# EAGLE design working (EAGLE 5.10)
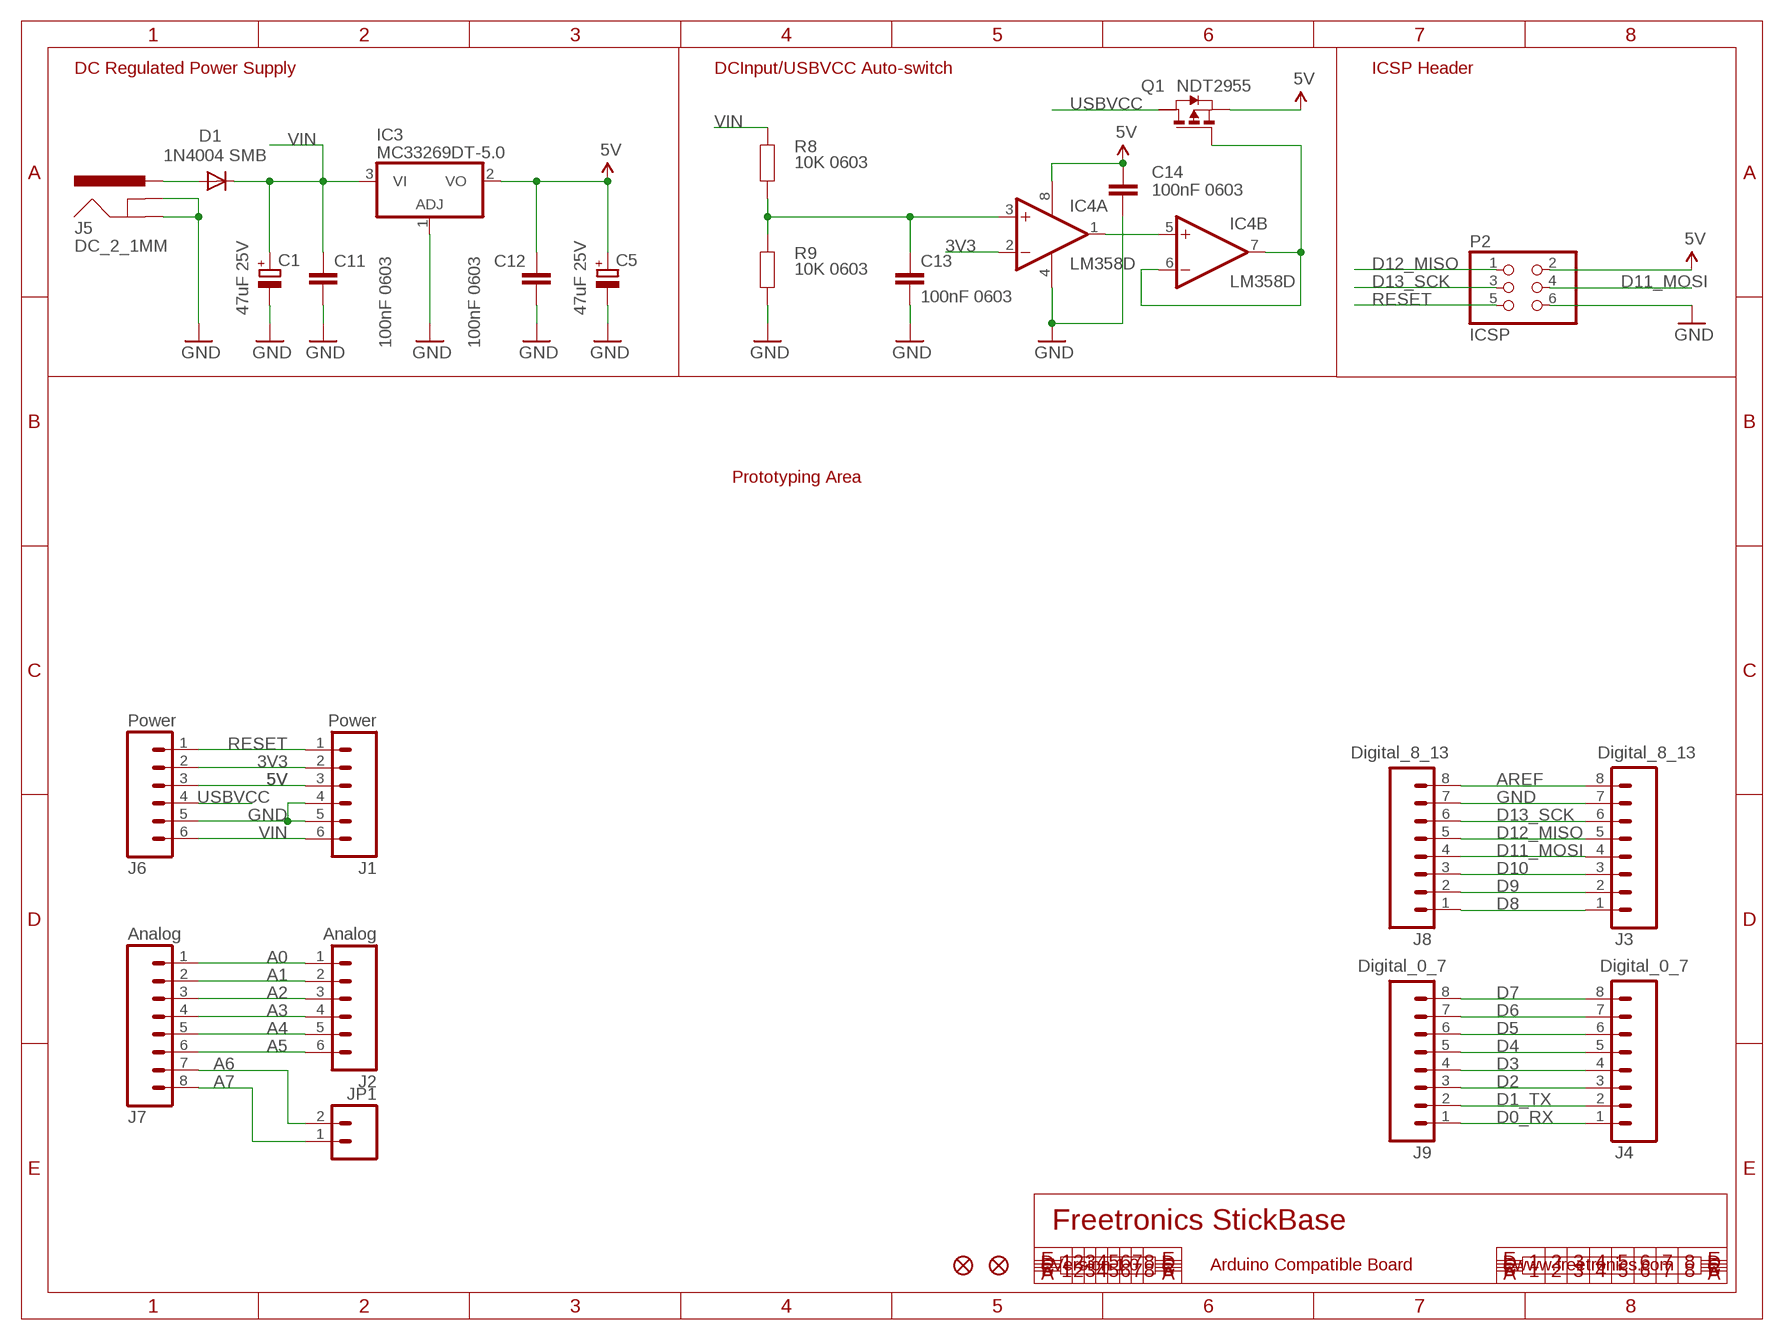
[diagram p0: schematic, sheet 1]

## Parts
C1  47uF 25V  CPOL-EUD  [PANASONIC_D]
C5  47uF 25V  CPOL-EUD  [PANASONIC_D]
C11  100nF 0603  CAP0603  [0603]
C12  100nF 0603  CAP0603  [0603]
C13  100nF 0603  CAP0603  [0603]
C14  100nF 0603  CAP0603  [0603]
D1  1N4004 SMB  DIODESMB  [SMB-DIODE]
IC3  MC33269DT-5.0  MC33269D-5.0  [DPACK]
IC4  LM358D  [SO08]
J1  Power  M06SIP  [1X06]
J2  Analog  M06SIP  [1X06]
J3  Digital_8_13  M08  [1X08]
J4  Digital_0_7  M08  [1X08]
J5  DC_2_1MM  POWER_JACKPTH  [POWER_JACK_PTH]
J6  Power  M06SIP  [1X06]
J7  Analog  M08  [1X08]
J8  Digital_8_13  M08  [1X08]
J9  Digital_0_7  M08  [1X08]
JP1  M02PTH  [1X02]
P2  ICSP  PINHD-2X3  [2X03]
Q1  NDT2955  PMOSSOT223  [SOT223]
R8  10K 0603  RESISTOR0603  [0603]
R9  10K 0603  RESISTOR0603  [0603]
U$5  FIDUCIAL1X2.5  [FIDUCIAL-1X2.5]
U$14  FIDUCIAL1X2.5  [FIDUCIAL-1X2.5]

## Nets
3V3: IC4.2(A:-IN) J1.2 J6.2
5V: C5.+ C12.1 C14.1 IC3.2(VO) IC4.8(P:V+) J1.3 J6.3 P2.2 Q1.3(S)
A0: J2.1 J7.1
A1: J2.2 J7.2
A2: J2.3 J7.3
A3: J2.4 J7.4
A4: J2.5 J7.5
A5: J2.6 J7.6
A6: J7.7 JP1.2
A7: J7.8 JP1.1
AREF: J3.8 J8.8
D0_RX: J4.1 J9.1
D1_TX: J4.2 J9.2
D2: J4.3 J9.3
D3: J4.4 J9.4
D4: J4.5 J9.5
D5: J4.6 J9.6
D6: J4.7 J9.7
D7: J4.8 J9.8
D8: J3.1 J8.1
D9: J3.2 J8.2
D10: J3.3 J8.3
D11_MOSI: J3.4 J8.4 P2.4
D12_MISO: J3.5 J8.5 P2.1
D13_SCK: J3.6 J8.6 P2.3
GND: C1.- C5.- C11.2 C12.2 C13.2 C14.2 IC3.1(ADJ) IC4.4(P:V-) J1.4 J1.5 J3.7 J5.GND J5.GNDBREAK J6.5 J8.7 P2.6 R9.1
N$8: D1.A J5.PWR
N$9: C13.1 IC4.3(A:+IN) R8.1 R9.2
N$16: IC4.6(B:-IN) IC4.7(B:OUT) Q1.1(G)
N$17: IC4.1(A:OUT) IC4.5(B:+IN)
RESET: J1.1 J6.1 P2.5
USBVCC: J6.4 Q1.2(D)
VIN: C1.+ C11.1 D1.C IC3.3(VI) J1.6 J6.6 R8.2
Unconnected: Q1.4(D2)

## Notes on the sheet
- DC Regulated Power Supply | DCInput/USBVCC Auto-switch | ICSP Header
- Prototyping Area
- Freetronics StickBase
- Version 1.0 | Arduino Compatible Board | www.freetronics.com

## Library data of the parts
C1 C5 = rcl:CPOL-EU: POLARIZED CAPACITOR, European symbol
C11-C14 = freetronics:CAP: Capacitor Standard 0603 ceramic capacitor, and 0.1" leaded capacitor.
D1 = freetronics:DIODE: Diode These are standard reverse protection diodes and small signal diodes. SMA package can handle up to about 1A. SOD-323 can handle about 200mA. What the SOD-323 package when ordering, there are some mfgs out there that are 5-pin packages.
IC3 = linear:MC33269?*: Adjustable Output Low Dropout Voltage Regulator 800 mA Source: http://www.onsemi.com/pub/Collateral/MC33269-D.PDF
IC4 = linear:LM358: OP AMP also LM158; LM258; LM2904 Source: http://cache.national.com/ds/LM/LM158.pdf
J1 J2 J6 = freetronics:M06: Header 6 Standard 6-pin 0.1" header. Use with straight break away headers (SKU : PRT-00116), right angle break away headers (PRT-00553), swiss pins (PRT-00743), machine pins (PRT-00117), and female headers (PRT-00115). Molex polarized connector foot print use with SKU : PRT-08094 with associated crimp pins and housings. NOTES ON THE VARIANTS LOCK and LOCK_LONGPADS... This footprint was designed to help hold the alignment of a through-hole component (i.e. 6-pin header) while soldering it into place. You may notice that each hole has been shifted either up or down by 0.005 of an inch from it's more standard position (which is a perfectly straight line). This slight alteration caused the pins (the squares in the middle) to touch the edges of the holes. Because they are alternating, it causes a "brace" to hold the component in place. 0.005 has proven to be the perfect amount of "off-center" position when using our standard breakaway headers. Although looks a little odd when you look at the bare footprint, once you have a header in there, the alteration is very hard to notice. Also, if you push a header all the way into place, it is covered up entirely on the bottom side. This idea of altering the position of holes to aid alignment will be further integrated into the Sparkfun Library for other footprints. It can help hold any component with 3 or more connection pins.
J3 J4 J8 J9 = freetronics:M08: Header 8 Standard 8-pin 0.1" header. Use with straight break away headers (SKU : PRT-00116), right angle break away headers (PRT-00553), swiss pins (PRT-00743), machine pins (PRT-00117), and female headers (PRT-00115).
J5 = freetronics:POWER_JACK: Power Jack This is the standard 5.5mm barrel jack for power. The PTH is the most common, proven, reliable, footprint. All others are experimental. The Slot footprint only works if the mill layer is transmitted to the PCB fab house so be warned. Spark Fun Electronics SKU : PRT-00119. Mating wall wart : TOL-00298 (and others)
J7 = freetronics-master-v1:M08: Header 8 Standard 8-pin 0.1" header. Use with straight break away headers (SKU : PRT-00116), right angle break away headers (PRT-00553), swiss pins (PRT-00743), machine pins (PRT-00117), and female headers (PRT-00115).
JP1 = freetronics-master-v1:M02: Header 2 Standard 2-pin 0.1" header. Use with straight break away headers (SKU : PRT-00116), right angle break away headers (PRT-00553), swiss pins (PRT-00743), machine pins (PRT-00117), and female headers (PRT-00115). Molex polarized connector foot print use with SKU : PRT-08233 with associated crimp pins and housings.
P2 = pinhead:PINHD-2X3: PIN HEADER
Q1 = zetex:PMOSSOT223: MOS FET
R8 R9 = freetronics:RESISTOR: Resistor Basic schematic elements and footprints for 0603, 1206, and PTH 1/10th watt (small) resistors.
U$5 U$14 = freetronics:FIDUCIAL: Fiducial Alignment Points Various fiducial points for machine vision alignment.

## Board
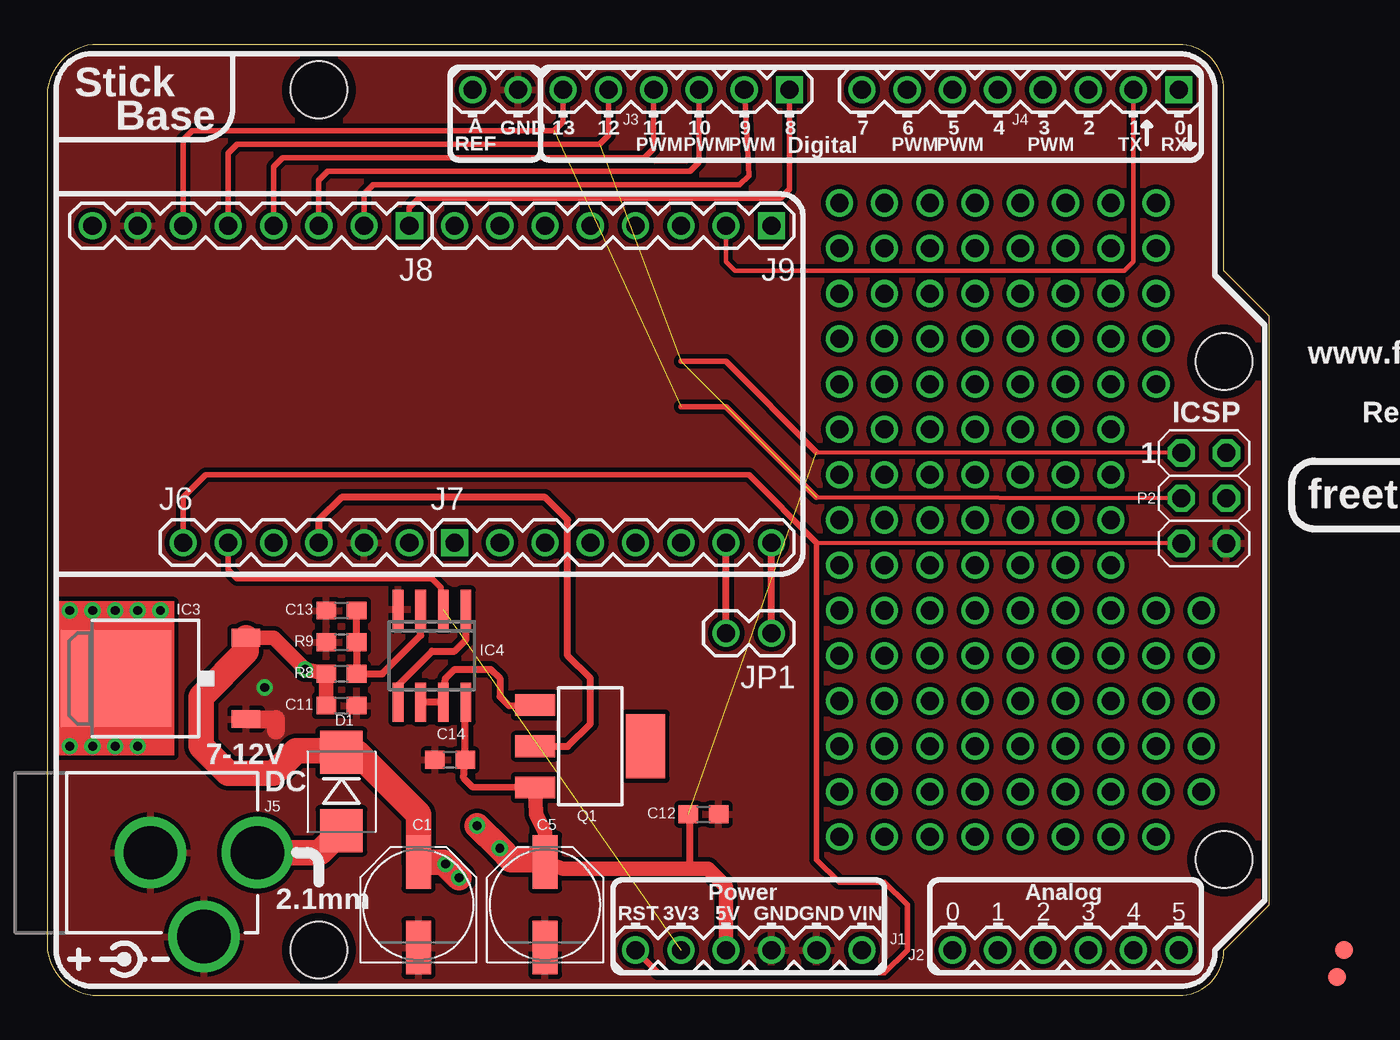
[diagram p1: board, top side]
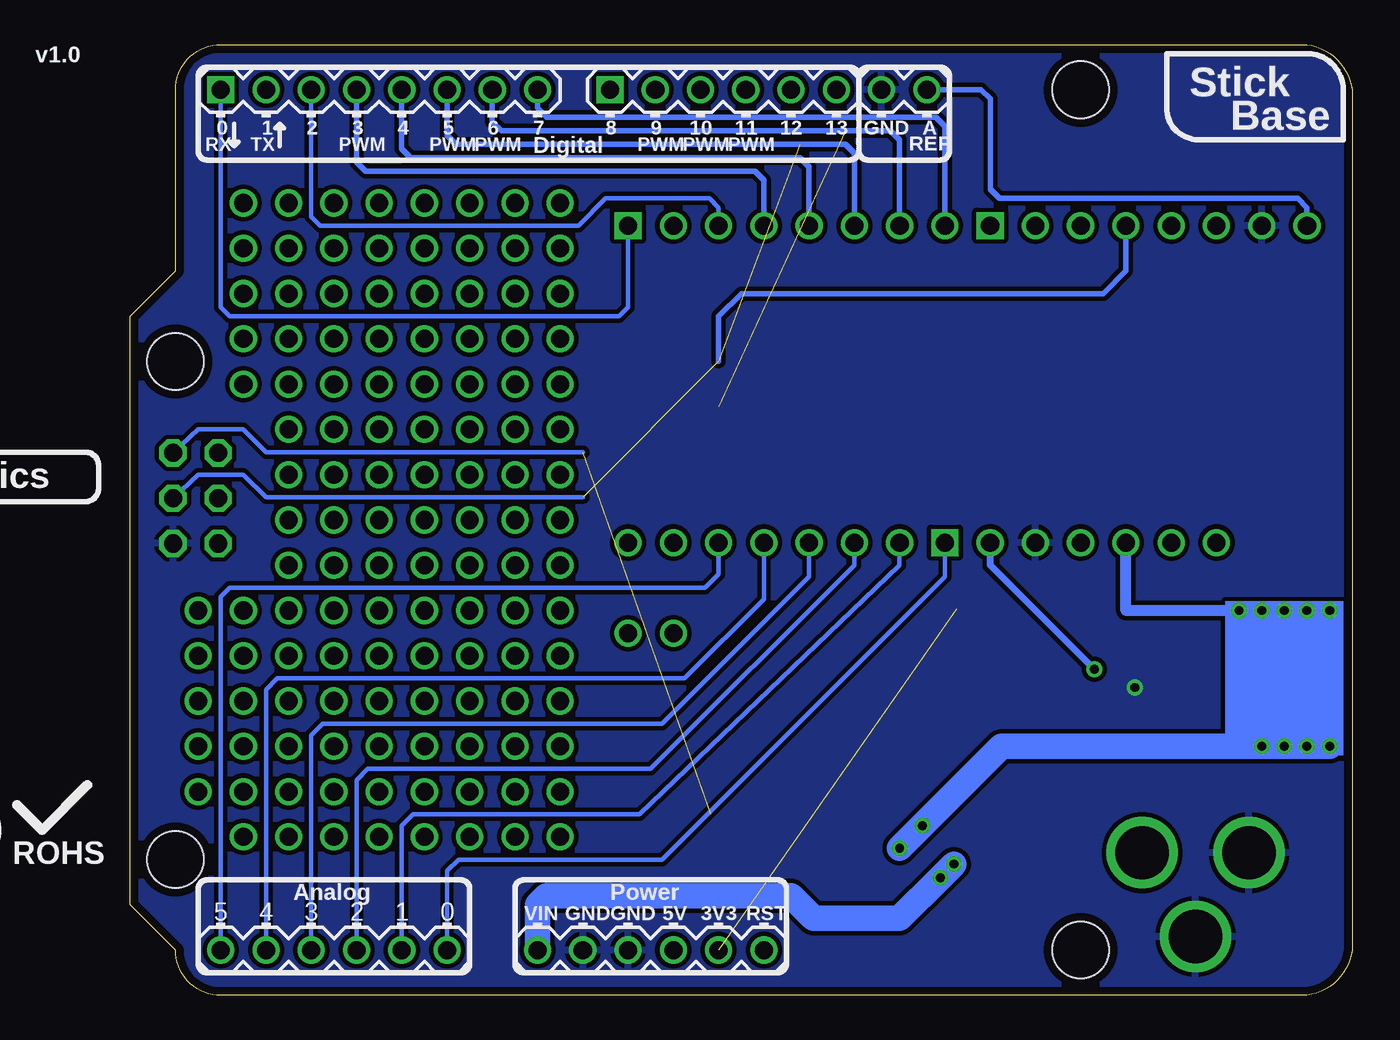
[diagram p2: board, bottom side, seen from below]

Size 68.58 x 53.34 mm. Coordinates in mm from the lower left corner, seen from the top.
Outline: 0,2.54 arc74 2.54,0 63.5,0 arc90 66.04,2.54 68.58,5.08 68.58,38.1 66.04,40.64 66.04,50.8 arc90 63.5,53.34 2.54,53.34 arc74 0,50.8 0,2.54
Copper layers (1*16): Top 0.035mm / dielectric 1.5mm / Bottom 0.035mm
Design rules "default *": minimum track width 10mil, minimum drill 18mil, track to track 10mil, track to pad 10mil, pad to pad 10mil, via to via 10mil, smd to smd 8mil, copper to edge 18mil, drill to drill 8mil, minimum pad ring 10mil, minimum via ring 8mil, stop-mask expansion 4mil, vias tented up to drill 25mil, thermal gap 10mil
Holes 3.2 mm at 66.04,35.56 66.04,7.62 15.24,50.8 15.24,2.54
tRestrict: area 74.3,2.8 to 76.3,4.8; area 77.7,1.3 to 79.8,3.3

### Footprints (pad centres in the part's own frame; a part is rotated, then mirrored left to right if it is on the bottom)
PANASONIC_D = smd 3 x 1.4: + 2.4,0; - -2.4,0
0603 = smd 1.1 x 1: 1 -0.85,0; 2 0.85,0
SMB-DIODE = smd 2.4 x 2.4: A 2.2,0; C -2.2,0
DPACK = smd 1 x 1.6: 1 -2.28,-4.8; 3 2.28,-4.8 | smd 5.4 x 6.2: 2 0,2.5
SO08 = smd 0.6 x 2.2: 1 -1.905,-2.6; 2 -0.635,-2.6; 3 0.635,-2.6; 4 1.905,-2.6; 5 1.905,2.6; 6 0.635,2.6; 7 -0.635,2.6; 8 -1.905,2.6
1X06 = drill 1.016 round: 1 0,0; 2 2.54,0; 3 5.08,0; 4 7.62,0; 5 10.16,0; 6 12.7,0
1X08 = drill 1.016 square: 1 0,0 | drill 1.016 round: 2 2.54,0; 3 5.08,0; 4 7.62,0; 5 10.16,0; 6 12.7,0; 7 15.24,0; 8 17.78,0
POWER_JACK_PTH = drill 2.997 round: GND 0,7.7; GNDBREAK 4.7,10.7; PWR 0,13.7
1X02 = drill 1.016 round: 1 0,0; 2 2.54,0
2X03 = drill 1.016 octagon: 1 -2.54,-1.27; 2 -2.54,1.27; 3 0,-1.27; 4 0,1.27; 5 2.54,-1.27; 6 2.54,1.27
SOT223 = smd 1.219 x 2.235: 1 -2.311,-3.099; 2 0,-3.099; 3 2.311,-3.099 | smd 3.6 x 2.2: 4 0,3.099
FIDUCIAL-1X2.5 = smd 1 x 1: 1 0,0

### Placement (x,y rotation side)
C1  20.83,5.08 90 top
C5  27.94,5.08 90 top
C11  16.51,16.26 0 top
C12  36.83,10.16 0 top
C13  16.51,21.59 180 top
C14  22.61,13.21 180 top
D1  16.51,11.43 270 top
IC3  6.35,17.78 90 top
IC4  21.59,19.05 180 top
J1  33.02,2.54 0 top
J2  50.8,2.54 0 top
J3  41.66,50.8 180 top
J4  63.5,50.8 180 top
J5  -1.91,8 270 top
J6  7.62,25.4 0 top
J7  22.86,25.4 0 top
J8  20.32,43.18 180 top
J9  40.64,43.18 180 top
JP1  40.64,20.32 180 top
P2  64.91,27.89 270 top
Q1  30.48,13.97 270 top
R8  16.51,18.03 180 top
R9  16.51,19.81 0 top
U$5  72.77,2.54 0 top  (outside the outline)
U$14  72.39,1.02 0 top  (outside the outline)

### Tracks (layer width: path | path; a pad name or v marks a point on that pad's centre or on a via)
3V3  (1 unrouted)
  Top 0.305: IC4.2 22.1,22.61 22.1,22.86 21.59,23.37 10.67,23.37 10.16,23.88 J6.2
5V  (via drill 0.5)  (1 unrouted)
  Top 0.406: IC4.8 23.46,16.41 C14.1 23.37,12.19 23.88,11.68 Q1.3 | v3.81,13.97 v2.54,13.97 v1.27,13.97 v5.08,13.97 v3.81,13.97 | v3.81,13.97 3.81,17.27 IC3.2 | v1.27,21.59 v2.54,21.59 v3.81,21.59 v5.08,21.59 | C12.1 36.07,9.65 36.07,7.11
  Top 0.61: v6.35,21.59 v5.08,21.59 IC3.2
  Top 0.813: J1.3 38.1,6.1 37.08,7.11 36.07,7.11 28.96,7.11 C5.+ | C5.+ 27.94,9.14 27.43,10.16 Q1.3 | 27.3,7.62 C5.+
  Top 1.422: 27.3,7.62 26.04,7.62 v25.4,8.26 v24.13,9.53
  Bottom 0.254: P2.2 64.77,31.75 62.23,31.75 60.96,30.48 43.18,30.48
  Bottom 0.61: v6.35,21.59 12.7,21.59 J6.3
  Bottom 1.422: v1.27,13.97 19.68,13.97 v25.4,8.26
A0
  Bottom 0.254: J7.1 22.86,23.5 38.73,7.62 50.16,7.62 50.8,6.99 J2.1
A1
  Bottom 0.254: J7.2 25.4,24.13 40.01,10.16 52.7,10.16 53.34,9.53 J2.2
A2
  Bottom 0.254: J7.3 27.94,24.13 39.37,12.7 55.24,12.7 55.88,12.06 J2.3
A3
  Bottom 0.254: J7.4 30.48,23.5 38.73,15.24 57.78,15.24 58.42,14.61 J2.4
A4
  Bottom 0.254: J7.5 33.02,22.23 37.47,17.78 60.33,17.78 60.96,17.14 J2.5
A5
  Bottom 0.254: J7.6 35.56,23.62 36.32,22.86 62.99,22.86 63.5,22.35 J2.6
A6
  Top 0.406: JP1.2 J7.7
A7
  Top 0.406: JP1.1 J7.8
AREF
  Bottom 0.305: J8.8 2.54,44.2 3.05,44.7 19.81,44.7 20.32,45.21 20.32,50.29 20.83,50.8 J3.8
D0_RX
  Bottom 0.254: J4.1 63.5,38.61 62.99,38.1 41.15,38.1 40.64,38.61 J9.1
D1_TX
  Top 0.254: J9.2 38.1,41.15 38.61,40.64 60.45,40.64 60.96,41.15 J4.2
D2
  Bottom 0.254: J9.3 35.56,44.2 36.07,44.7 41.91,44.7 43.43,43.18 57.91,43.18 58.42,43.69 J4.3
D3
  Bottom 0.305: J9.4 33.02,45.72 33.53,46.23 55.37,46.23 55.88,46.74 J4.4
D4
  Bottom 0.305: J9.5 30.48,46.48 30.99,46.99 52.83,46.99 53.34,47.5 J4.5
D5
  Bottom 0.305: J9.6 27.94,47.24 28.45,47.75 50.29,47.75 50.8,48.26 J4.6
D6
  Bottom 0.305: J9.7 25.4,48.01 25.91,48.51 47.75,48.51 48.26,49.02 J4.7
D7
  Bottom 0.305: J9.8 22.86,48.77 23.37,49.28 45.21,49.28 45.72,49.78 J4.8
D8
  Top 0.305: J8.1 20.32,44.2 20.83,44.7 41.15,44.7 41.66,45.21 J3.1
D9
  Top 0.305: J8.2 17.78,44.96 18.29,45.47 38.86,45.47 39.37,45.97 J3.2
D10
  Top 0.305: J8.3 15.24,45.72 15.75,46.23 36.07,46.23 36.58,46.74 J3.3
D11_MOSI  (1 unrouted)
  Top 0.305: J8.4 12.7,46.48 13.21,46.99 33.53,46.99 34.04,47.5 J3.4
  Bottom 0.254: P2.4 64.77,29.21 62.23,29.21 60.96,27.94 43.18,27.94
  Bottom 0.305: 35.56,35.56 35.56,38.1 34.29,39.37 13.97,39.37 12.7,40.64 J8.4
D12_MISO  (1 unrouted)
  Top 0.254: 43.18,30.48 P2.1
  Top 0.305: J8.5 10.16,47.24 10.67,47.75 30.99,47.75 31.5,48.26 J3.5 | 43.18,30.48 38.1,35.56 35.56,35.56
D13_SCK  (1 unrouted)
  Top 0.254: 43.18,27.94 P2.3
  Top 0.305: J8.6 7.62,48.01 8.13,48.51 28.45,48.51 28.96,49.02 J3.6 | 43.18,27.94 38.1,33.02 35.56,33.02
GND  (via drill 0.5)
  Top 1.016: 12.83,14.86 12.83,15.5 IC3.1
  other vias: 12.19,17.27
  pour Bottom: 0,50.8 arc-74 2.54,53.34 63.5,53.34 arc-74 66.04,50.8 66.04,40.64 68.58,38.1 68.58,5.08 66.04,2.54 arc-74 63.5,0 2.54,0 arc-74 0,2.54
  pour Top: 0,50.8 arc-74 2.54,53.34 63.5,53.34 arc-74 66.04,50.8 66.04,40.64 68.58,38.1 68.58,5.08 66.04,2.54 arc-74 63.5,0 2.54,0 arc-74 0,2.54
N$1  (via drill 1.02)
  other vias: 44.45,36.83
N$2  (via drill 1.02)
  other vias: 44.45,39.37
N$3  (via drill 1.02)
  other vias: 44.45,41.91
N$4  (via drill 1.02)
  other vias: 49.53,36.83
N$5  (via drill 1.02)
  other vias: 49.53,39.37
N$6  (via drill 1.02)
  other vias: 49.53,41.91
N$7  (via drill 1.02)
  other vias: 46.99,36.83
N$8
  Top 1.422: D1.A 15.28,8 J5.PWR
N$9
  Top 0.406: C13.1 R9.2 R8.1 18.8,18.03 20.95,20.19 IC4.3 20.83,22.35
N$10  (via drill 1.02)
  other vias: 46.99,39.37
N$11  (via drill 1.02)
  other vias: 46.99,41.91
N$12  (via drill 1.02)
  other vias: 44.45,29.21
N$13  (via drill 1.02)
  other vias: 44.45,31.75
N$14  (via drill 1.02)
  other vias: 44.45,34.29
N$15  (via drill 1.02)
  other vias: 49.53,29.21
N$16
  Top 0.406: Q1.1 25.91,16.26 25.4,16.76 25.4,17.78 24.89,18.29 22.86,18.29 22.35,17.78 IC4.7 IC4.6
N$17
  Top 0.406: IC4.5 19.68,17.4 21.59,19.3 22.86,19.3 23.5,19.94 IC4.1
N$18  (via drill 1.02)
  other vias: 49.53,31.75
N$19  (via drill 1.02)
  other vias: 49.53,34.29
N$20  (via drill 1.02)
  other vias: 46.99,29.21
N$21  (via drill 1.02)
  other vias: 46.99,31.75
N$22  (via drill 1.02)
  other vias: 46.99,34.29
N$23  (via drill 1.02)
  other vias: 52.07,36.83
N$24  (via drill 1.02)
  other vias: 52.07,39.37
N$25  (via drill 1.02)
  other vias: 52.07,41.91
N$26  (via drill 1.02)
  other vias: 57.15,36.83
N$27  (via drill 1.02)
  other vias: 57.15,39.37
N$28  (via drill 1.02)
  other vias: 57.15,41.91
N$29  (via drill 1.02)
  other vias: 54.61,36.83
N$30  (via drill 1.02)
  other vias: 54.61,39.37
N$31  (via drill 1.02)
  other vias: 54.61,41.91
N$32  (via drill 1.02)
  other vias: 52.07,29.21
N$33  (via drill 1.02)
  other vias: 52.07,31.75
N$34  (via drill 1.02)
  other vias: 52.07,34.29
N$35  (via drill 1.02)
  other vias: 57.15,29.21
N$36  (via drill 1.02)
  other vias: 57.15,31.75
N$37  (via drill 1.02)
  other vias: 57.15,34.29
N$38  (via drill 1.02)
  other vias: 54.61,29.21
N$39  (via drill 1.02)
  other vias: 54.61,31.75
N$40  (via drill 1.02)
  other vias: 54.61,34.29
N$41  (via drill 1.02)
  other vias: 59.69,36.83
N$42  (via drill 1.02)
  other vias: 59.69,39.37
N$43  (via drill 1.02)
  other vias: 59.69,41.91
N$44  (via drill 1.02)
  other vias: 62.23,36.83
N$45  (via drill 1.02)
  other vias: 62.23,39.37
N$46  (via drill 1.02)
  other vias: 62.23,41.91
N$47  (via drill 1.02)
  other vias: 59.69,29.21
N$48  (via drill 1.02)
  other vias: 59.69,31.75
N$49  (via drill 1.02)
  other vias: 59.69,34.29
N$50  (via drill 1.02)
  other vias: 49.53,21.59
N$51  (via drill 1.02)
  other vias: 46.99,21.59
N$52  (via drill 1.02)
  other vias: 44.45,21.59
N$53  (via drill 1.02)
  other vias: 49.53,26.67
N$54  (via drill 1.02)
  other vias: 46.99,26.67
N$55  (via drill 1.02)
  other vias: 44.45,26.67
N$56  (via drill 1.02)
  other vias: 62.23,34.29
N$57  (via drill 1.02)
  other vias: 49.53,8.89
N$58  (via drill 1.02)
  other vias: 46.99,8.89
N$59  (via drill 1.02)
  other vias: 49.53,13.97
N$60  (via drill 1.02)
  other vias: 46.99,13.97
N$61  (via drill 1.02)
  other vias: 44.45,13.97
N$62  (via drill 1.02)
  other vias: 49.53,24.13
N$63  (via drill 1.02)
  other vias: 46.99,24.13
N$64  (via drill 1.02)
  other vias: 44.45,24.13
N$65  (via drill 1.02)
  other vias: 57.15,21.59
N$66  (via drill 1.02)
  other vias: 54.61,21.59
N$67  (via drill 1.02)
  other vias: 52.07,21.59
N$68  (via drill 1.02)
  other vias: 57.15,26.67
N$69  (via drill 1.02)
  other vias: 54.61,26.67
N$70  (via drill 1.02)
  other vias: 52.07,26.67
N$71  (via drill 1.02)
  other vias: 57.15,24.13
N$72  (via drill 1.02)
  other vias: 54.61,24.13
N$73  (via drill 1.02)
  other vias: 52.07,24.13
N$74  (via drill 1.02)
  other vias: 59.69,21.59
N$75  (via drill 1.02)
  other vias: 59.69,24.13
N$76  (via drill 1.02)
  other vias: 59.69,26.67
N$77  (via drill 1.02)
  other vias: 49.53,19.05
N$78  (via drill 1.02)
  other vias: 46.99,19.05
N$79  (via drill 1.02)
  other vias: 44.45,19.05
N$80  (via drill 1.02)
  other vias: 57.15,19.05
N$81  (via drill 1.02)
  other vias: 54.61,19.05
N$82  (via drill 1.02)
  other vias: 52.07,19.05
N$83  (via drill 1.02)
  other vias: 59.69,19.05
N$84  (via drill 1.02)
  other vias: 49.53,16.51
N$85  (via drill 1.02)
  other vias: 46.99,16.51
N$86  (via drill 1.02)
  other vias: 44.45,16.51
N$87  (via drill 1.02)
  other vias: 57.15,16.51
N$88  (via drill 1.02)
  other vias: 54.61,16.51
N$89  (via drill 1.02)
  other vias: 57.15,13.97
N$90  (via drill 1.02)
  other vias: 54.61,13.97
N$91  (via drill 1.02)
  other vias: 52.07,13.97
N$92  (via drill 1.02)
  other vias: 52.07,16.51
N$93  (via drill 1.02)
  other vias: 59.69,16.51
N$94  (via drill 1.02)
  other vias: 62.23,21.59
N$95  (via drill 1.02)
  other vias: 64.77,21.59
N$96  (via drill 1.02)
  other vias: 62.23,19.05
N$97  (via drill 1.02)
  other vias: 64.77,19.05
N$98  (via drill 1.02)
  other vias: 44.45,8.89
N$99  (via drill 1.02)
  other vias: 57.15,8.89
N$100  (via drill 1.02)
  other vias: 62.23,16.51
N$101  (via drill 1.02)
  other vias: 59.69,13.97
N$102  (via drill 1.02)
  other vias: 49.53,11.43
N$103  (via drill 1.02)
  other vias: 46.99,11.43
N$104  (via drill 1.02)
  other vias: 44.45,11.43
N$105  (via drill 1.02)
  other vias: 57.15,11.43
N$106  (via drill 1.02)
  other vias: 54.61,11.43
N$107  (via drill 1.02)
  other vias: 54.61,8.89
N$108  (via drill 1.02)
  other vias: 52.07,8.89
N$109  (via drill 1.02)
  other vias: 59.69,8.89
N$110  (via drill 1.02)
  other vias: 62.23,8.89
N$111  (via drill 1.02)
  other vias: 44.45,44.45
N$112  (via drill 1.02)
  other vias: 49.53,44.45
N$113  (via drill 1.02)
  other vias: 64.77,16.51
N$114  (via drill 1.02)
  other vias: 52.07,11.43
N$115  (via drill 1.02)
  other vias: 59.69,11.43
N$116  (via drill 1.02)
  other vias: 62.23,13.97
N$117  (via drill 1.02)
  other vias: 64.77,13.97
N$118  (via drill 1.02)
  other vias: 62.23,11.43
N$119  (via drill 1.02)
  other vias: 64.77,11.43
N$120  (via drill 1.02)
  other vias: 46.99,44.45
N$121  (via drill 1.02)
  other vias: 52.07,44.45
N$122  (via drill 1.02)
  other vias: 57.15,44.45
N$123  (via drill 1.02)
  other vias: 54.61,44.45
N$124  (via drill 1.02)
  other vias: 59.69,44.45
N$125  (via drill 1.02)
  other vias: 62.23,44.45
RESET
  Top 0.254: 43.18,25.4 P2.5
  Top 0.305: J6.1 7.62,27.94 8.89,29.21 39.37,29.21 43.18,25.4 43.18,7.62 44.45,6.35 46.99,6.35 48.26,5.08 48.26,2.54 46.99,1.27 34.29,1.27 J1.1
USBVCC
  Top 0.406: J6.4 15.24,26.67 16.51,27.94 27.94,27.94 29.21,26.67 29.21,19.05 30.48,17.78 30.48,15.24 29.21,13.97 Q1.2
VIN  (via drill 0.5)
  Top 0.813: IC3.3 12.71,20.06 v14.48,18.29 R8.2 C11.1
  Top 1.422: IC3.3 11.17,19.3 8.64,16.76 8.64,13.97 10.16,12.45 12.7,12.45 13.97,13.72 16.42,13.72 D1.C 17.36,13.63 20.83,10.16 C1.+ 22.24,7.48 v22.35,7.37 v23.11,6.6
  Bottom 0.406: J6.6 20.32,24.13 v14.48,18.29
  Bottom 1.422: J1.6 45.72,5.08 45.21,5.59 31.5,5.59 30.23,4.32 25.4,4.32 v23.11,6.6 v22.35,7.37
(copper drawn outside any net)
  shapes: Bottom area x1, Top area x1

### Text on the board
tPlace: Stick | Base | A | GND | 13 | 12 | 11 | 10 | 9 | 8 | 7 | 6 | 5 | 4 | 3 | 2 | 1 | 0 | REF | PWM | PWM | PWM | Digital | PWM | PWM | PWM | TX | RX | www.freetronics.com | USBRESET | ICSP | Reset | 1 | freetronics | 7-12V | DC | 2.1mm | Power | Analog | RST | 3V3 | 5V | GND | GND | VIN | 0 | 1 | 2 | 3 | 4 | 5
bPlace: v1.0 | Stick | Base | A | GND | 13 | 12 | 11 | 10 | 9 | 8 | 7 | 6 | 5 | 4 | 3 | 2 | 1 | 0 | REF | PWM | PWM | PWM | Digital | PWM | PWM | PWM | TX | RX | freetronics | +5V | CC | ROHS | Power | Analog | RST | 3V3 | 5V | GND | GND | VIN | 0 | 1 | 2 | 3 | 4 | 5 | GND